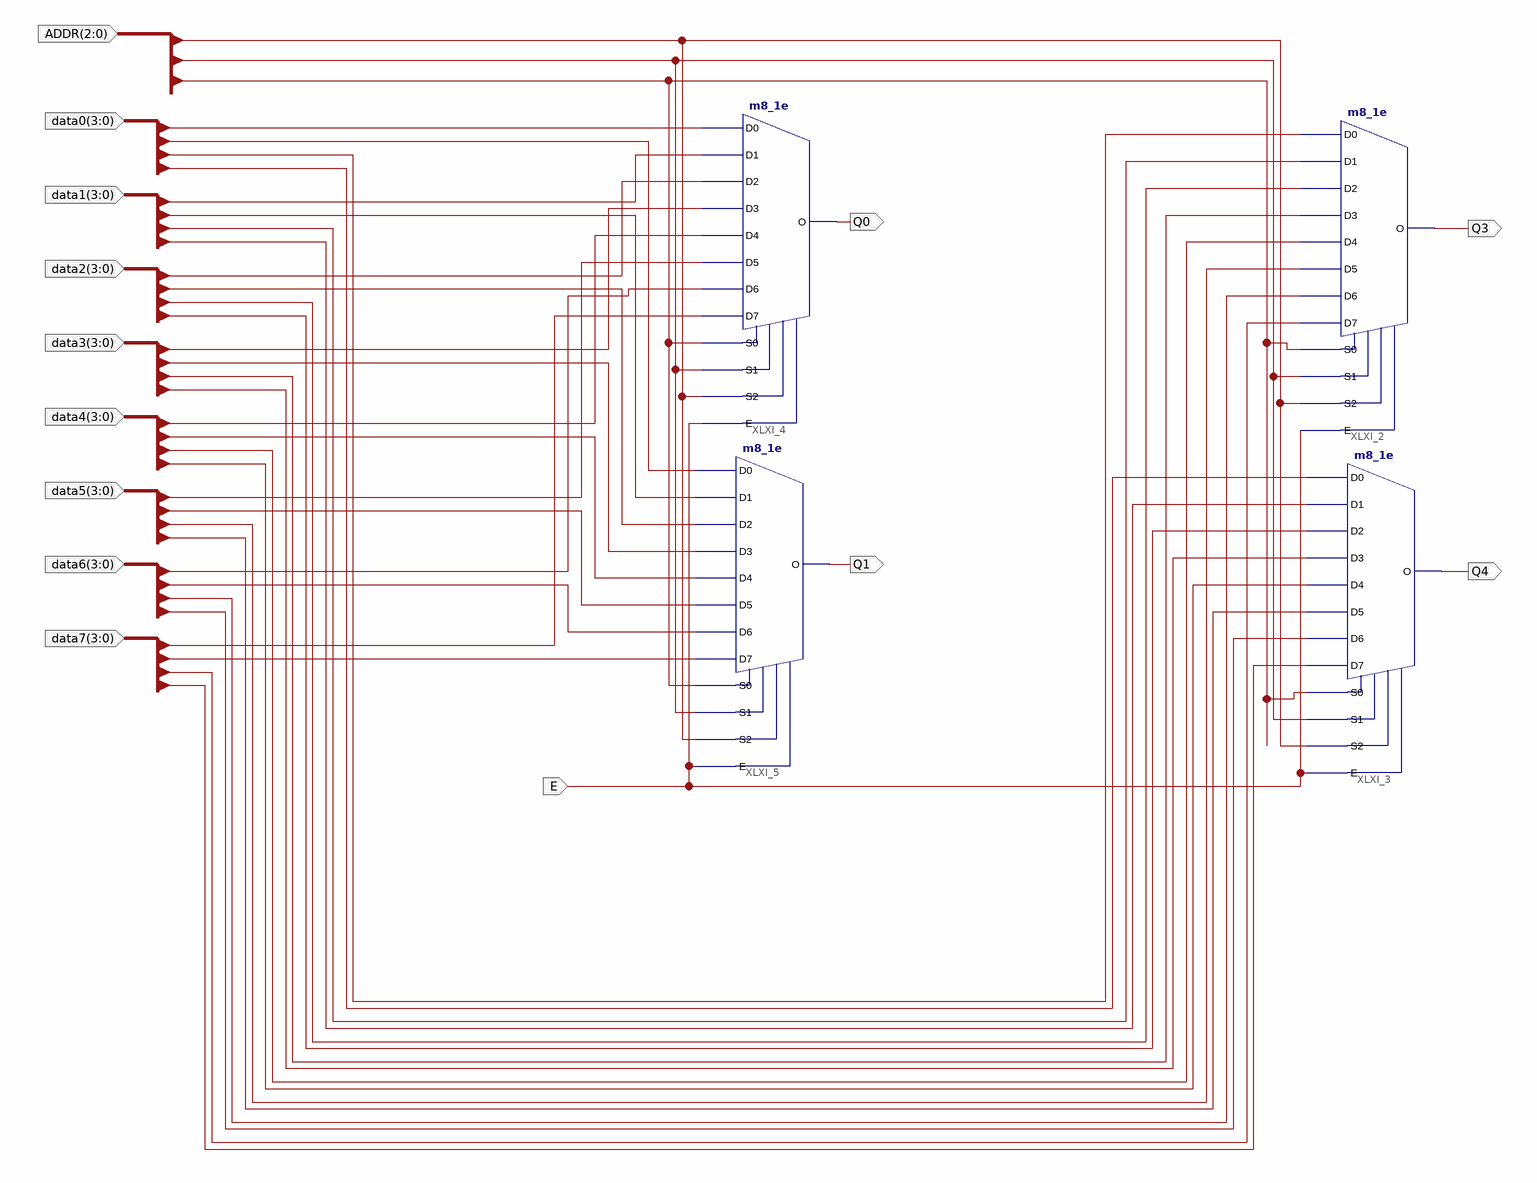
[diagram p0: schematic sheet 1]
// Xilinx ISE schematic butts.sch (spartan3e) as structural Verilog: 4 symbols, 14 ports
module butts (
  input  [2:0] ADDR,
  input  [3:0] data0,
  input  [3:0] data1,
  input  [3:0] data2,
  input  [3:0] data3,
  input  [3:0] data4,
  input  [3:0] data5,
  input  [3:0] data6,
  input  [3:0] data7,
  input  E,
  output Q3,
  output Q0,
  output Q1,
  output Q4
);

  m8_1e XLXI_2 (
    .D0(data0[2]), .D1(data1[2]), .D2(data2[2]), .D3(data3[2]), .D4(data4[2]), .D5(data5[2]), .D6(data6[2]),
    .D7(data7[2]), .E(E), .S0(ADDR[2]), .S1(ADDR[1]), .S2(ADDR[0]), .O(Q3));
  m8_1e XLXI_4 (
    .D0(data0[0]), .D1(data1[0]), .D2(data2[0]), .D3(data3[0]), .D4(data4[0]), .D5(data5[0]), .D6(data6[0]),
    .D7(data7[0]), .E(E), .S0(ADDR[2]), .S1(ADDR[1]), .S2(ADDR[0]), .O(Q0));
  m8_1e XLXI_5 (
    .D0(data0[1]), .D1(data1[1]), .D2(data2[1]), .D3(data3[1]), .D4(data4[1]), .D5(data5[1]), .D6(data6[1]),
    .D7(data7[1]), .E(E), .S0(ADDR[2]), .S1(ADDR[1]), .S2(ADDR[0]), .O(Q1));
  m8_1e XLXI_3 (
    .D0(data0[3]), .D1(data1[3]), .D2(data2[3]), .D3(data3[3]), .D4(data4[3]), .D5(data5[3]), .D6(data6[3]),
    .D7(data7[3]), .E(E), .S0(ADDR[2]), .S1(ADDR[1]), .S2(ADDR[0]), .O(Q4));
endmodule
